# EAGLE design PowerSensingBoard (EAGLE 7.5.0)
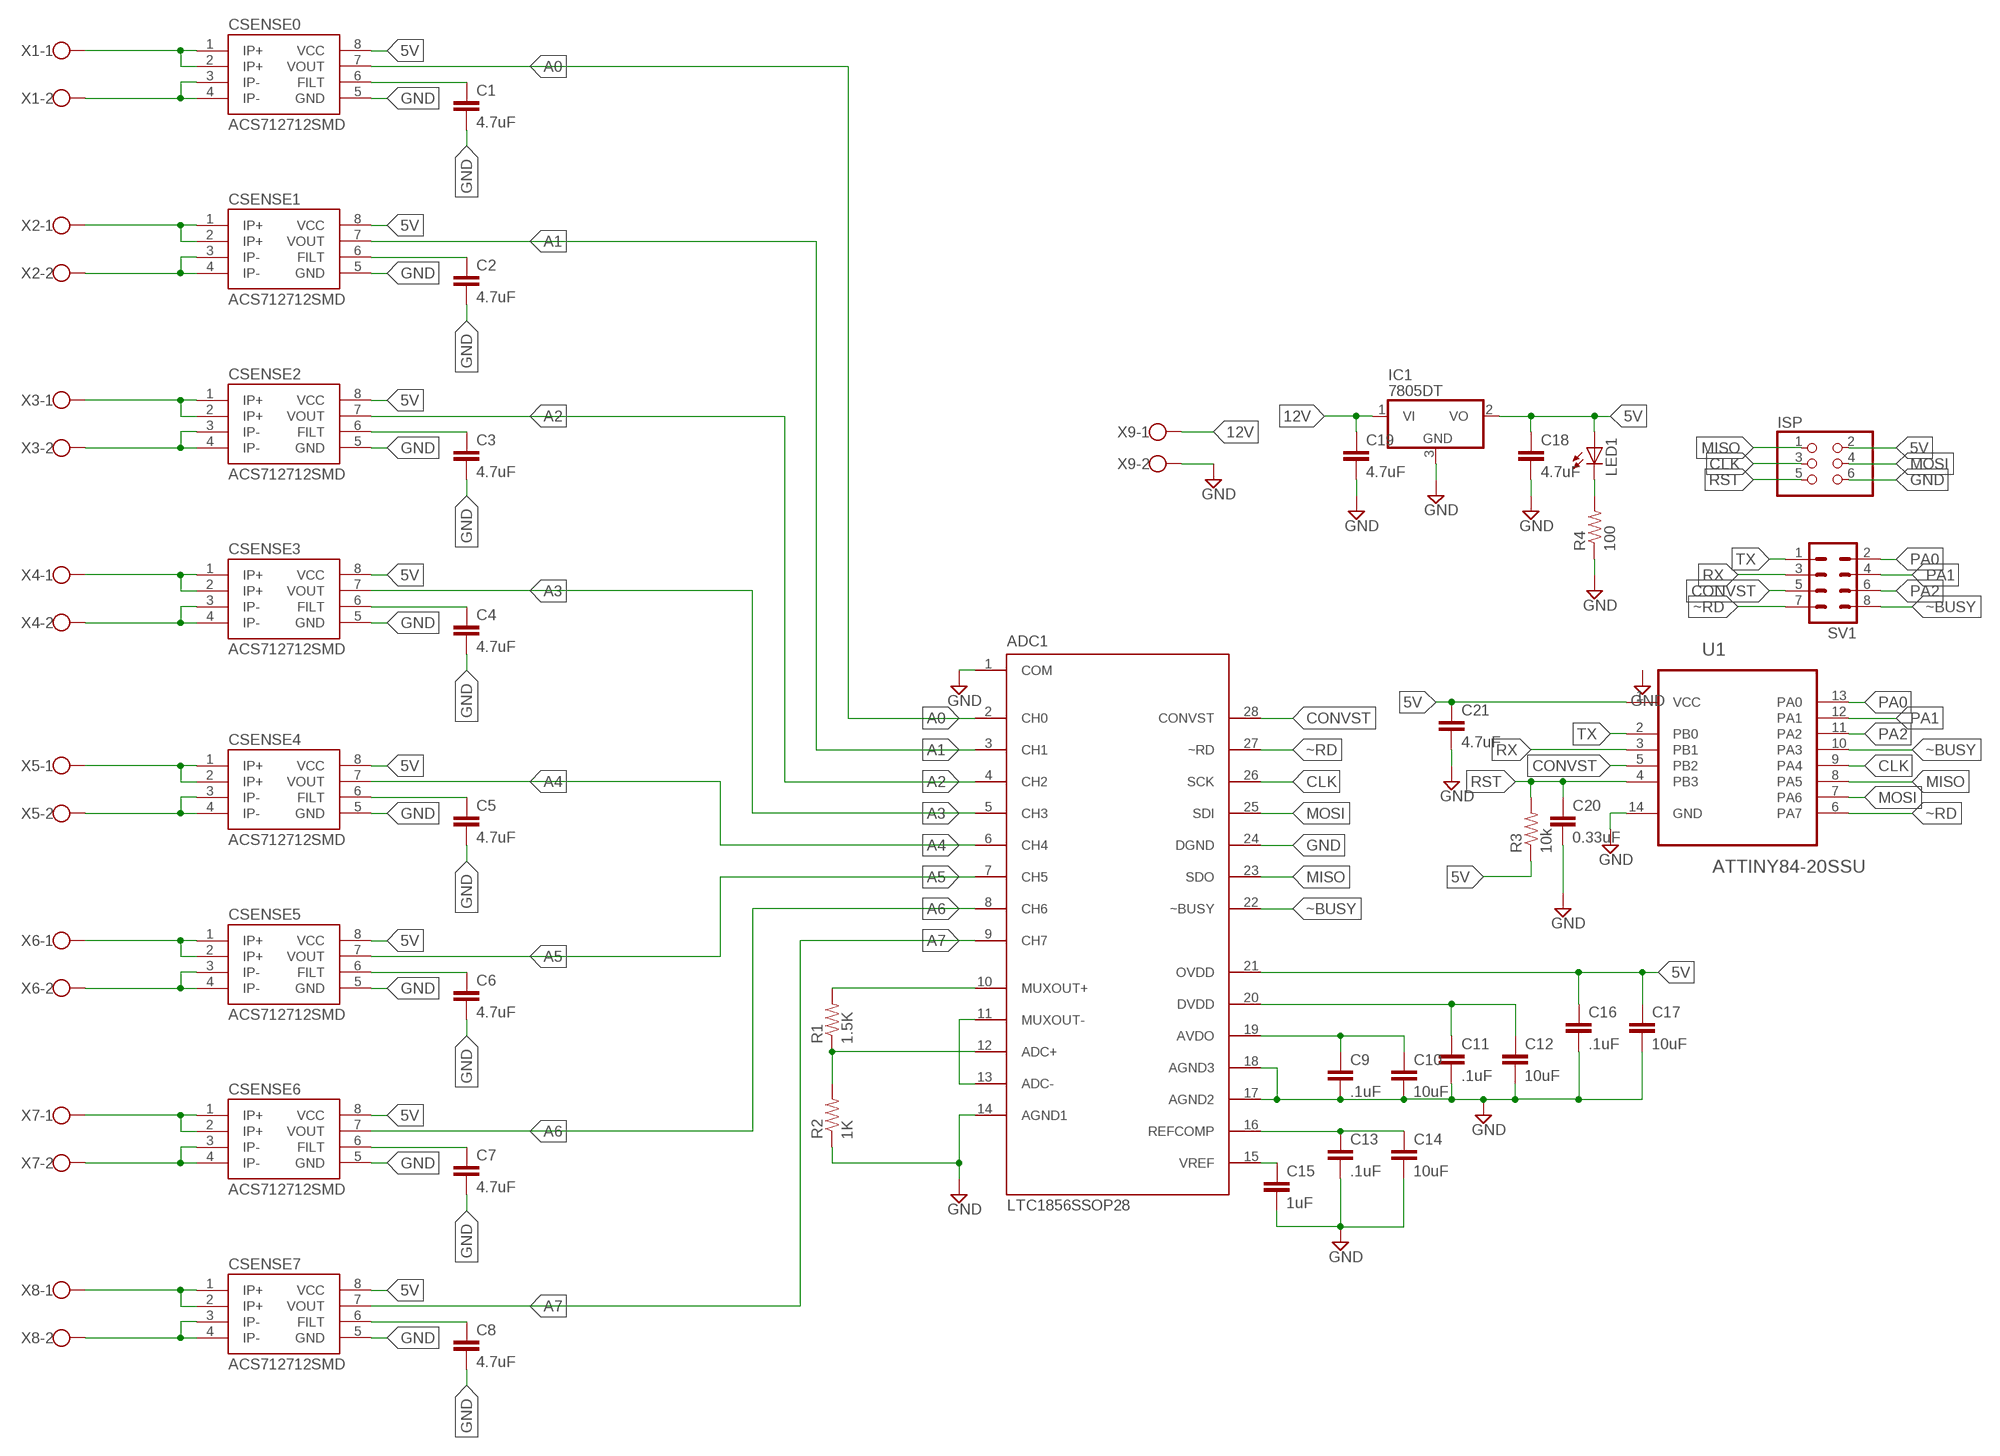
[diagram p0: schematic, sheet 1]

## Parts
ADC1  LTC1856SSOP28  [SSOP-28]
C1  4.7uF  4.7UF-6.3V-10%(0603)0603  [0603-CAP]
C2  4.7uF  4.7UF-6.3V-10%(0603)0603  [0603-CAP]
C3  4.7uF  4.7UF-6.3V-10%(0603)0603  [0603-CAP]
C4  4.7uF  4.7UF-6.3V-10%(0603)0603  [0603-CAP]
C5  4.7uF  4.7UF-6.3V-10%(0603)0603  [0603-CAP]
C6  4.7uF  4.7UF-6.3V-10%(0603)0603  [0603-CAP]
C7  4.7uF  4.7UF-6.3V-10%(0603)0603  [0603-CAP]
C8  4.7uF  4.7UF-6.3V-10%(0603)0603  [0603-CAP]
C9  .1uF  4.7UF-6.3V-10%(0603)0603  [0603-CAP]
C10  10uF  4.7UF-6.3V-10%(0603)0603  [0603-CAP]
C11  .1uF  4.7UF-6.3V-10%(0603)0603  [0603-CAP]
C12  10uF  4.7UF-6.3V-10%(0603)0603  [0603-CAP]
C13  .1uF  4.7UF-6.3V-10%(0603)0603  [0603-CAP]
C14  10uF  4.7UF-6.3V-10%(0603)0603  [0603-CAP]
C15  1uF  4.7UF-6.3V-10%(0603)0603  [0603-CAP]
C16  .1uF  4.7UF-6.3V-10%(0603)0603  [0603-CAP]
C17  10uF  4.7UF-6.3V-10%(0603)0603  [0603-CAP]
C18  4.7uF  4.7UF-6.3V-10%(0603)0603  [0603-CAP]
C19  4.7uF  4.7UF-6.3V-10%(0603)0603  [0603-CAP]
C20  0.33uF  0.33UF-50V-10%(0805)  [0805-CAP]
C21  4.7uF  4.7UF-6.3V-10%(0603)0603  [0603-CAP]
CSENSE0  ACS712712SMD  [SO08]
CSENSE1  ACS712712SMD  [SO08]
CSENSE2  ACS712712SMD  [SO08]
CSENSE3  ACS712712SMD  [SO08]
CSENSE4  ACS712712SMD  [SO08]
CSENSE5  ACS712712SMD  [SO08]
CSENSE6  ACS712712SMD  [SO08]
CSENSE7  ACS712712SMD  [SO08]
IC1  7805DT  [TO252]
ISP  PINHD-2X3  [2X03]
LED1  LEDCHIP-LED0805  [CHIP-LED0805]
R1  1.5K  1KOHM-1/10W-1%(0603)  [0603-RES]
R2  1K  1KOHM-1/10W-1%(0603)  [0603-RES]
R3  10k  0.3OHM-1/8W-1%(0805)  [0805]
R4  100  1KOHM-1/10W-1%(0603)  [0603-RES]
SV1  MA04-2  [MA04-2]
U1  ATTINY84-20SSU  [SOIC127P600X175-14N]
X1  W237-102  [W237-102]
X2  W237-102  [W237-102]
X3  W237-102  [W237-102]
X4  W237-102  [W237-102]
X5  W237-102  [W237-102]
X6  W237-102  [W237-102]
X7  W237-102  [W237-102]
X8  W237-102  [W237-102]
X9  W237-102  [W237-102]

## Nets
5V: ADC1.21(OVDD) C16.1 C17.1 C18.1 C21.1 CSENSE0.8(VCC) CSENSE1.8(VCC) CSENSE2.8(VCC) CSENSE3.8(VCC) CSENSE4.8(VCC) CSENSE5.8(VCC) CSENSE6.8(VCC) CSENSE7.8(VCC) IC1.2(VO) ISP.2 LED1.A R3.1 U1.1(VCC)
12V: C19.1 IC1.1(VI) X9.1
A0: ADC1.2(CH0) CSENSE0.7(VOUT)
A1: ADC1.3(CH1) CSENSE1.7(VOUT)
A2: ADC1.4(CH2) CSENSE2.7(VOUT)
A3: ADC1.5(CH3) CSENSE3.7(VOUT)
A4: ADC1.6(CH4) CSENSE4.7(VOUT)
A5: ADC1.7(CH5) CSENSE5.7(VOUT)
A6: ADC1.8(CH6) CSENSE6.7(VOUT)
A7: ADC1.9(CH7) CSENSE7.7(VOUT)
CLK: ADC1.26(SCK) ISP.3 U1.9(PA4)
CONVST: ADC1.28(CONVST) SV1.5 U1.5(PB2)
FILT1: C1.1 CSENSE0.6(FILT)
FILT2: C2.1 CSENSE1.6(FILT)
FILT3: C3.1 CSENSE2.6(FILT)
FILT4: C4.1 CSENSE3.6(FILT)
FILT5: C5.1 CSENSE4.6(FILT)
FILT6: C6.1 CSENSE5.6(FILT)
FILT7: C7.1 CSENSE6.6(FILT)
FILT8: C8.1 CSENSE7.6(FILT)
GND: ADC1.1(COM) ADC1.14(AGND1) ADC1.17(AGND2) ADC1.18(AGND3) ADC1.24(DGND) C1.2 C2.2 C3.2 C4.2 C5.2 C6.2 C7.2 C8.2 C9.2 C10.2 C11.2 C12.2 C13.2 C14.2 C15.2 C16.2 C17.2 C18.2 C19.2 C20.2 C21.2 CSENSE0.5(GND) CSENSE1.5(GND) CSENSE2.5(GND) CSENSE3.5(GND) CSENSE4.5(GND) CSENSE5.5(GND) CSENSE6.5(GND) CSENSE7.5(GND) IC1.3(GND) ISP.6 R2.1 R4.1 U1.14(GND) X9.2
INT1: CSENSE0.1(IP+) CSENSE0.2(IP+) X1.1
INT2: CSENSE1.1(IP+) CSENSE1.2(IP+) X2.1
INT3: CSENSE2.1(IP+) CSENSE2.2(IP+) X3.1
INT4: CSENSE3.1(IP+) CSENSE3.2(IP+) X4.1
INT5: CSENSE4.1(IP+) CSENSE4.2(IP+) X5.1
INT6: CSENSE5.1(IP+) CSENSE5.2(IP+) X6.1
INT7: CSENSE6.1(IP+) CSENSE6.2(IP+) X7.1
INT8: CSENSE7.1(IP+) CSENSE7.2(IP+) X8.1
LED1: LED1.C R4.2
MISO: ADC1.23(SDO) ISP.1 U1.8(PA5)
MOSI: ADC1.25(SDI) ISP.4 U1.7(PA6)
MUXOUT+: ADC1.10(MUXOUT+) R1.2
MUXOUT-: ADC1.12(ADC+) R1.1 R2.2
N$5: ADC1.11(MUXOUT-) ADC1.13(ADC-)
N$10: ADC1.20(DVDD) C11.1 C12.1
N$11: ADC1.19(AVDO) C9.1 C10.1
N$12: ADC1.15(VREF) C15.1
N$13: ADC1.16(REFCOMP) C13.1 C14.1
OUTT1: CSENSE0.3(IP-) CSENSE0.4(IP-) X1.2
OUTT2: CSENSE1.3(IP-) CSENSE1.4(IP-) X2.2
OUTT3: CSENSE2.3(IP-) CSENSE2.4(IP-) X3.2
OUTT4: CSENSE3.3(IP-) CSENSE3.4(IP-) X4.2
OUTT5: CSENSE4.3(IP-) CSENSE4.4(IP-) X5.2
OUTT6: CSENSE5.3(IP-) CSENSE5.4(IP-) X6.2
OUTT7: CSENSE6.3(IP-) CSENSE6.4(IP-) X7.2
OUTT8: CSENSE7.3(IP-) CSENSE7.4(IP-) X8.2
PA0: SV1.2 U1.13(PA0)
PA1: SV1.4 U1.12(PA1)
PA2: SV1.6 U1.11(PA2)
RST: C20.1 ISP.5 R3.2 U1.4(PB3)
RX: SV1.3 U1.3(PB1)
TX: SV1.1 U1.2(PB0)
~BUSY: ADC1.22(~BUSY) SV1.8 U1.10(PA3)
~RD: ADC1.27(~RD) SV1.7 U1.6(PA7)

## Library data of the parts
ADC1 = HostlerLib:LTC1856
C1-C8 C18 C19 C21 = SparkFun-Capacitors:4.7UF-6.3V-10%(0603): CAP-08280; PROD_ID: CAP-08280
C9-C17 = SparkFun-Capacitors:4.7UF-6.3V-10%(0603): CAP-08280; PROD_ID: CAP-08280; VALUE: 4.7uF
C20 = SparkFun-Capacitors:0.33UF-50V-10%(0805): CAP-08469; PROD_ID: CAP-08469
CSENSE0 CSENSE1-CSENSE7 = SparkFun-AnalogIC:ACS712: Hall-effect-based isolated linear current sensor; PROD_ID: IC-08964
IC1 = adafruit:78*: Positive VOLTAGE REGULATOR Added bigger pads to the TO-92 package
ISP = SparkFun-Connectors:PINHD-2X3: PIN HEADER
LED1 = adafruit:LED: LED OSRAM: - CHIPLED LG R971, LG N971, LY N971, LG Q971, LY Q971, LO R971, LY R971 LH N974, LH R974 LS Q976, LO Q976, LY Q976 LO Q996 - Hyper CHIPLED LW Q18S LB Q993, LB Q99A, LB R99A - SideLED LS A670, LO A670, LY A670, LG A670, LP A670 LB A673, LV A673, LT A673, LW A673 LH A674 LY A675 LS A676, LA A676, LO A676, LY A676, LW A676 LS A679, LY A679, LG A679 - Hyper Micro SIDELED® LS Y876, LA Y876, LO Y876, LY Y876 LT Y87S - SmartLED LW L88C, LW L88S LB L89C, LB L89S, LG L890 LS L89K, LO L89K, LY L89K LS L896, LA L896, LO L896, LY L896 - TOPLED LS T670, LO T670, LY T670, LG T670, LP T670 LSG T670, LSP T670, LSY T670, LOP T670, LYG T670 LG T671, LOG T671, LSG T671 LB T673, LV T673, LT T673, LW T673 LH T674 LS T676, LA T676, LO T676, LY T676, LB T676, LH T676, LSB T676, LW T676 LB T67C, LV T67C, LT T67C, LS T67K, LO T67K, LY T67K, LW E67C LS E67B, LA E67B, LO E67B, LY E67B, LB E67C, LV E67C, LT E67C LW T67C LS T679, LY T679, LG T679 LS T770, LO T770, LY T770, LG T770, LP T770 LB T773, LV T773, LT T773, LW T773 LH T774 LS E675, LA E675, LY E675, LS T675 LS T776, LA T776, LO T776, LY T776, LB T776 LHGB T686 LT T68C, LB T68C - Hyper Mini TOPLED® LB M676 - Mini TOPLED Santana® LG M470 LS M47K, LO M47K, LY M47K Source: http://www.osram.convergy.de/
R1 R4 = SparkFun-Resistors:1KOHM-1/10W-1%(0603): RES-07856; PROD_ID: RES-07856; VALUE: 1K
R2 = SparkFun-Resistors:1KOHM-1/10W-1%(0603): RES-07856; PROD_ID: RES-07856
R3 = SparkFun-Resistors:0.3OHM-1/8W-1%(0805): RES-11622; PROD_ID: RES-11622; VALUE: 0.3
SV1 = con-lstb:MA04-2: PIN HEADER; OC_FARNELL: unknown; OC_NEWARK: unknown
U1 = Atmel_By_element14_Batch_1-00:ATTINY84-20SSU: 8-bit Microcontroller with Bytes In-System Programmable Flash; MPN: ATTINY84-20SSU; OC_FARNELL: 1636955; OC_NEWARK: 03P2040; PACKAGE: SOIC-14; SUPPLIER: Atmel
X1-X9 = con-wago-500:W237-102: WAGO SCREW CLAMP; MPN: 237-102; OC_FARNELL: unknown; OC_NEWARK: 70K9898

## Board
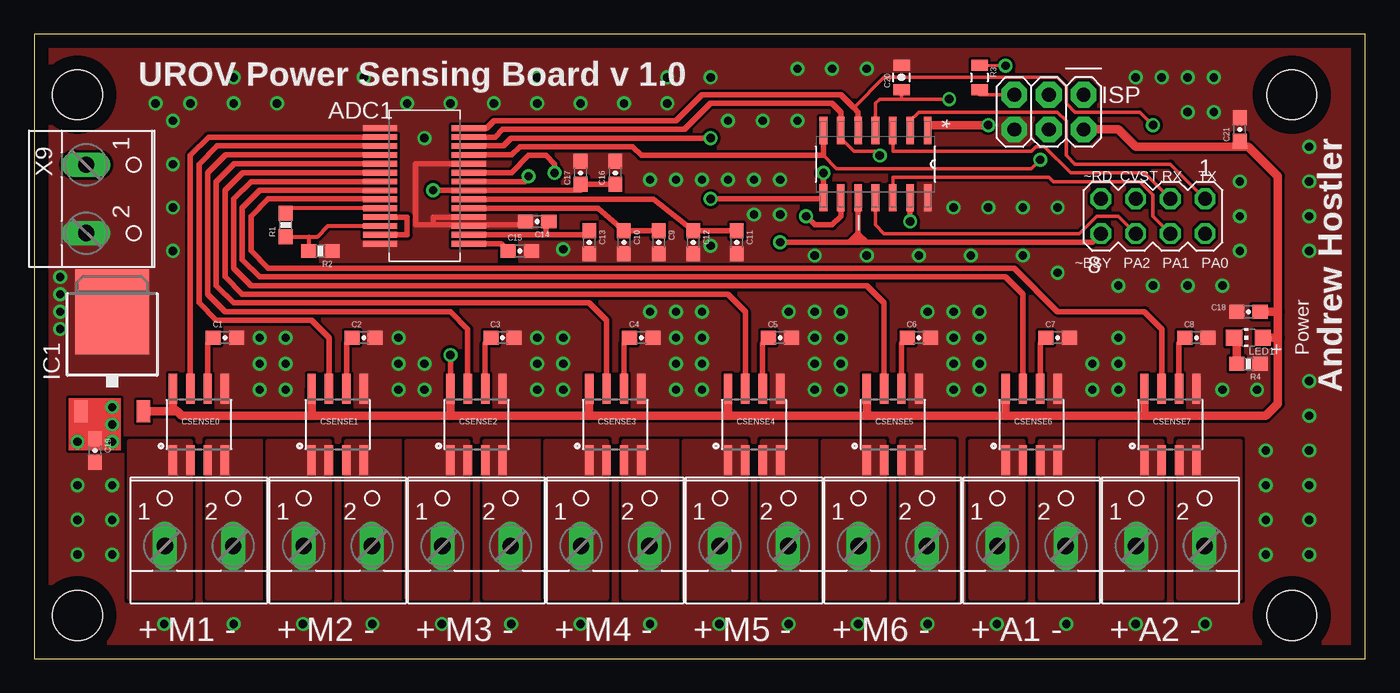
[diagram p1: board, top side]
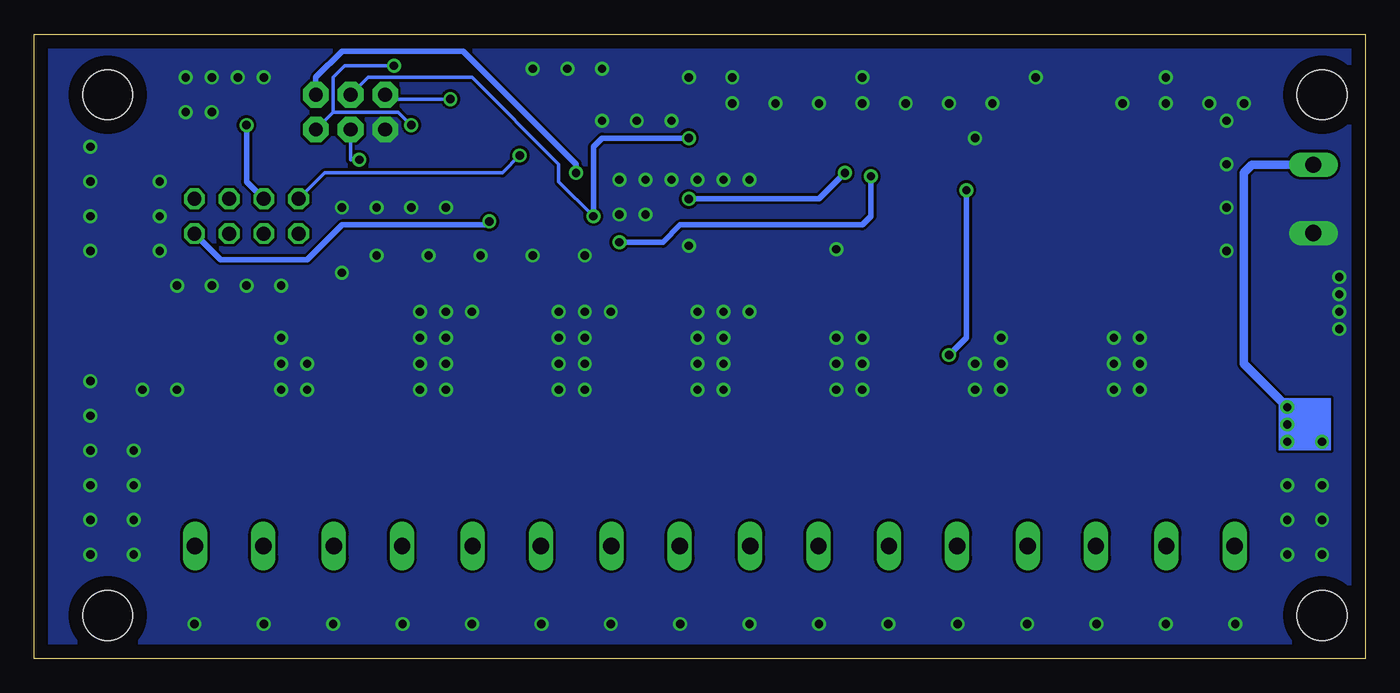
[diagram p2: board, bottom side, seen from below]

Size 97.46 x 45.71 mm. Coordinates in mm from the lower left corner, seen from the top.
Outline: 0,0 97.46,0 97.46,45.71 0,45.71 0,0
Copper layers (1*16): Top 0.035mm / dielectric 1.5mm / Bottom 0.035mm
Design rules "default *": minimum track width 10mil, minimum drill 20mil, track to track 8mil, track to pad 8mil, pad to pad 8mil, via to via 8mil, smd to smd 8mil, copper to edge 40mil, drill to drill 8mil, minimum pad ring 10mil, minimum via ring 8mil, stop-mask expansion 4mil, vias tented up to drill 0mil, thermal gap 10mil
Holes 3.66 mm at 3.17,3.17 3.17,41.27 92.08,41.27 92.08,3.17

### Footprints (pad centres in the part's own frame; a part is rotated, then mirrored left to right if it is on the bottom)
SSOP-28 = smd 2.5 x 0.42: 1 -3.25,3.9; 2 -3.25,3.25; 3 -3.25,2.6; 4 -3.25,1.95; 5 -3.25,1.3; 6 -3.25,0.65; 7 -3.25,0; 8 -3.25,-0.65; 9 -3.25,-1.3; 10 -3.25,-1.95; 11 -3.25,-2.6; 12 -3.25,-3.25; 13 -3.25,-3.9; 14 -3.25,-4.55; 15 3.25,-4.55; 16 3.25,-3.9; 17 3.25,-3.25; 18 3.25,-2.6; 19 3.25,-1.95; 20 3.25,-1.3; 21 3.25,-0.65; 22 3.25,0; 23 3.25,0.65; 24 3.25,1.3; 25 3.25,1.95; 26 3.25,2.6; 27 3.25,3.25; 28 3.25,3.9
0603-CAP = smd 1.1 x 1: 1 -0.85,0; 2 0.85,0
0805-CAP = smd 0.8 x 1.2: 1 -0.9,0; 2 0.9,0
SO08 = smd 0.61 x 2.21: 1 -1.905,-2.616; 2 -0.635,-2.616; 3 0.635,-2.616; 4 1.905,-2.616; 5 1.905,2.616; 6 0.635,2.616; 7 -0.635,2.616; 8 -1.905,2.616
TO252 = smd 1 x 1.6: 1 -2.28,-4.8; 2 2.28,-4.8 | smd 5.4 x 6.2: 3 0,2.5
2X03 = drill 1.016 pad 1.88 octagon: 1 -2.54,-1.27; 2 -2.54,1.27; 3 0,-1.27; 4 0,1.27; 5 2.54,-1.27; 6 2.54,1.27
CHIP-LED0805 = smd 1.2 x 1.2: A 0,-1.05; C 0,1.05
0603-RES = smd 1.1 x 1: 1 -0.85,0; 2 0.85,0
0805 = smd 0.8 x 1.2: 1 -0.9,0; 2 0.9,0
MA04-2 = drill 1.016 octagon: 1 -3.81,-1.27; 2 -3.81,1.27; 3 -1.27,-1.27; 4 -1.27,1.27; 5 1.27,-1.27; 6 1.27,1.27; 7 3.81,-1.27; 8 3.81,1.27
SOIC127P600X175-14N = smd 1.981 x 0.559: 1 -2.464,3.81; 2 -2.464,2.54; 3 -2.464,1.27; 4 -2.464,0; 5 -2.464,-1.27; 6 -2.464,-2.54; 7 -2.464,-3.81; 8 2.464,-3.81; 9 2.464,-2.54; 10 2.464,-1.27; 11 2.464,0; 12 2.464,1.27; 13 2.464,2.54; 14 2.464,3.81
W237-102 = drill 1.194 long: 1 -2.5,-1.27; 2 2.5,-1.27

### Placement (x,y rotation side)
ADC1  28.57,34.92 0 top
C1  13.97,23.5 0 top
C2  24.13,23.5 0 top
C3  34.29,23.5 0 top
C4  44.45,23.5 0 top
C5  54.61,23.5 0 top
C6  64.77,23.5 0 top
C7  74.93,23.5 0 top
C8  85.09,23.5 0 top
C9  45.72,30.48 270 top
C10  43.18,30.48 270 top
C11  51.44,30.48 270 top
C12  48.26,30.48 270 top
C13  40.64,30.48 270 top
C14  36.83,32 180 top
C15  35.56,29.84 0 top
C16  42.55,35.56 90 top
C17  40.01,35.56 90 top
C18  88.9,25.4 180 top
C19  4.45,15.24 270 top
C20  63.5,42.55 90 top
C21  88.27,38.73 90 top
CSENSE0  12.06,17.14 0 top
CSENSE1  22.23,17.14 0 top
CSENSE2  32.38,17.14 0 top
CSENSE3  42.55,17.14 0 top
CSENSE4  52.7,17.14 0 top
CSENSE5  62.87,17.14 0 top
CSENSE6  73.03,17.14 0 top
CSENSE7  83.19,17.14 0 top
IC1  5.71,22.9 0 top
ISP  74.3,40.01 180 top
LED1  88.9,23.5 90 top
R1  18.41,31.75 90 top
R2  20.95,29.84 180 top
R3  69.22,42.55 270 top
R4  88.9,21.59 180 top
SV1  81.92,32.38 180 top
U1  61.59,36.2 270 top
X1  12.06,9.53 0 top
X2  22.23,9.53 0 top
X3  32.38,9.53 0 top
X4  42.55,9.53 0 top
X5  52.7,9.53 0 top
X6  62.87,9.53 0 top
X7  73.03,9.53 0 top
X8  83.19,9.53 0 top
X9  5.08,33.66 270 top

### Tracks (layer width: path | path; a pad name or v marks a point on that pad's centre or on a via)
5V  (via drill 0.61)
  Top 0.254: 65.41,38.73 U1.1 | R3.1 v71.12,43.4
  Top 0.406: C16.1 C17.1 40.01,34.27 ADC1.21 29.23,34.27 v29.21,34.29 | v30.48,22.23 CSENSE2.8 | 10.47,18.1 10.48,18.1 | C21.1 88.9,37.47
  Top 0.508: 65.72,39.05 65.41,38.73
  Top 0.61: 20.32,17.78 CSENSE1.8 | CSENSE2.8 30.48,17.78 | 30.48,17.78 20.32,17.78 | CSENSE3.8 40.64,17.78 | 40.64,17.78 30.48,17.78 | CSENSE4.8 50.8,17.78 | 50.8,17.78 40.64,17.78 | CSENSE5.8 60.96,17.78 | 60.96,17.78 50.8,17.78 | CSENSE6.8 71.12,17.78 | 71.12,17.78 60.96,17.78 | CSENSE7.8 81.28,17.78 | 81.28,17.78 71.12,17.78 | CSENSE0.8 10.16,18.41 10.48,18.1 10.79,17.78 20.32,17.78 | v69.85,39.05 65.72,39.05 | 81.28,17.78 90.17,17.78 91.06,18.68 91.06,23.5 | ISP.2 79.38,38.73 80.64,37.47 88.9,37.47 91.06,35.3 91.06,25.4 | 91.06,23.5 91.06,25.4 | C18.1 91.06,25.4 | LED1.A 91.06,23.5
  Top 0.635: IC1.2 10.47,18.1
  Bottom 0.254: v69.85,39.05 70.8,40.01 75.56,40.01 | v71.12,43.4 74.72,43.4 75.56,42.55 75.56,40.01 | 75.56,40.01 ISP.2
  Bottom 0.406: v29.21,34.29 29.21,23.5 v30.48,22.23
12V  (via drill 0.6)
  Top 0.406: 5.4,18.1 v3.17,15.88 | v5.71,18.41 v5.71,17.14 v5.71,15.88 C19.1
  Top 0.61: v5.71,18.41 5.4,18.1 IC1.1
  Bottom 0.61: X9.1 8.29,36.16 8.89,35.56 8.89,21.59 v5.71,18.41
A0
  Top 0.406: ADC1.2 12.78,38.17 11.43,36.83 CSENSE0.7
A1
  Top 0.406: ADC1.3 13.39,37.52 12.06,36.2 12.06,26.04 13.34,24.77 20.32,24.77 21.59,23.5 CSENSE1.7
A2
  Top 0.406: ADC1.4 14.02,36.88 12.7,35.56 12.7,26.67 13.97,25.4 30.48,25.4 31.75,24.13 CSENSE2.7
A3
  Top 0.406: ADC1.5 14.63,36.23 13.34,34.92 13.34,27.3 14.61,26.04 40.64,26.04 41.91,24.77 CSENSE3.7
A4
  Top 0.406: ADC1.6 15.26,35.58 13.97,34.29 13.97,27.94 15.24,26.67 50.8,26.67 52.07,25.4 CSENSE4.7
A5
  Top 0.406: ADC1.7 15.88,34.92 14.61,33.66 14.61,28.57 15.88,27.3 60.96,27.3 62.23,26.04 CSENSE5.7
A6
  Top 0.406: ADC1.8 16.5,34.27 15.24,33.02 15.24,29.21 16.51,27.94 71.12,27.94 72.39,26.67 CSENSE6.7
A7
  Top 0.406: ADC1.9 25.3,33.66 17.14,33.66 15.88,32.38 15.88,29.84 17.14,28.57 71.75,28.57 74.93,25.4 81.28,25.4 82.55,24.13 CSENSE7.7
CLK  (via drill 0.61)
  Top 0.406: ADC1.26 34.35,37.52 34.92,38.1 v49.53,38.1 | U1.9 59.05,32.38 58.42,31.75 57.15,31.75 v56.52,32.38
  Bottom 0.254: ISP.3 73.03,42.55 65.41,42.55 59.05,36.2 59.05,34.92 v56.52,32.38
  Bottom 0.406: v56.52,32.38 56.52,37.47 55.88,38.1 v49.53,38.1
CONVST  (via drill 0.61)
  Top 0.254: v81.92,39.05 80.96,40.01 76.2,40.01 75.56,40.64 75.56,41.91 74.93,42.55 62.23,42.55 60.01,40.32
  Top 0.406: ADC1.28 33.11,38.83 33.66,39.37 46.99,39.37 48.9,41.27 59.05,41.27 60.01,40.32 60.33,40.01 U1.5
  Bottom 0.406: v81.92,39.05 81.92,34.92 SV1.5
FILT1
  Top 0.406: CSENSE0.6 12.7,23.07 C1.1
FILT2
  Top 0.406: CSENSE1.6 22.86,23.07 C2.1
FILT3
  Top 0.406: CSENSE2.6 33.02,23.07 C3.1
FILT4
  Top 0.406: CSENSE3.6 43.18,23.07 C4.1
FILT5
  Top 0.406: CSENSE4.6 53.34,23.07 C5.1
FILT6
  Top 0.406: CSENSE5.6 63.5,23.07 C6.1
FILT7
  Top 0.406: CSENSE6.6 73.66,23.07 C7.1
FILT8
  Top 0.406: CSENSE7.6 83.82,23.07 C8.1
GND  (via drill 0.61)
  Top 0.406: ADC1.24 27.94,36.23 27.94,31.75 35.98,31.75 C14.2 | ADC1.18 29.21,32.33 29.21,31.75
  other vias: 16.51,21.59 26.67,21.59 36.83,21.59 46.99,21.59 57.15,21.59 67.31,21.59 77.47,21.59 87,27.3 79.38,27.3 3.17,12.7 3.17,7.62 86.36,40.01 84.45,40.01 90.17,12.7 93.34,7.62 55.88,43.18 54.61,35.05 46.35,42.55 28.57,38.1 27.3,40.64 14.61,40.64 8.89,40.64 52.7,35.05 38.73,29.97 54.61,32.51 52.7,32.51 46.99,35.05 45.09,35.05 18.41,21.59 28.57,21.59 38.73,21.59 48.9,21.59 59.05,21.59 69.22,21.59 79.38,21.59 81.92,27.3 84.45,27.3 69.85,33.02 72.39,33.02 74.93,33.02 67.31,33.02 49.53,30.23 57.15,29.51 60.96,29.51 64.77,29.51 68.58,29.51 72.39,29.51 74.93,28.24 84.45,42.55 86.36,42.55 82.55,42.55 80.64,42.55 33.66,40.64 36.83,40.64 40.01,40.64 43.18,40.64 14.61,2.54 19.68,2.54 24.77,2.54 29.84,2.54 34.92,2.54 40.01,2.54 45.09,2.54 50.16,2.54 55.24,2.54 60.33,2.54 65.41,2.54 70.48,2.54 75.56,2.54 80.64,2.54 85.72,2.54 50.8,39.37 53.34,39.37 55.88,39.37 89.53,19.68 87,19.68 93.34,29.84 93.34,20.32 93.34,17.78 18.41,23.5 18.41,19.68 28.57,19.68 26.67,19.68 16.51,19.68 36.83,19.68 38.73,19.68 48.9,23.5 48.9,19.68 46.99,19.68 38.73,23.5 59.05,23.5 59.05,19.68 57.15,19.68 69.22,23.5 69.22,19.68 67.31,19.68 79.38,23.5 79.38,19.68 77.47,19.68 67.31,23.5 67.31,25.4 69.22,25.4 65.41,25.4 57.15,25.4 59.05,25.4 57.15,23.5 55.24,25.4 46.99,23.5 46.99,25.4 48.9,25.4 45.09,25.4 36.83,23.5 26.67,23.5 16.51,23.5 93.34,32.38 93.34,34.92 93.34,37.47 93.34,15.24 93.34,12.7 93.34,10.16 1.91,27.94 1.91,26.67 1.91,25.4 1.91,24.13 3.17,10.16 5.71,12.7 5.71,10.16 5.71,7.62 11.43,40.64 17.78,40.64 30.48,40.64 58.42,43.18 60.96,43.18 88.27,29.84 88.27,32.38 88.27,34.92 10.16,39.37 10.16,36.2 10.16,33.02 10.16,29.84 9.53,2.54 90.17,15.24 90.17,10.16 90.17,7.62 48.9,35.05 50.8,35.05 49.53,42.55 36.83,42.55 46.35,40.64 14.61,42.55 24.13,42.55
  pour Top (rank 5, no thermals): 0,45.72 100.33,45.72 100.33,0 0,0
  pour Bottom (rank 4, no thermals): 0,45.72 97.79,45.72 97.79,0 0,0
INT1
  pour Top (no thermals): 6.99,15.88 11.43,15.88 11.43,4.45 6.99,4.45
INT2
  pour Top (no thermals): 17.14,15.88 21.59,15.88 21.59,4.45 17.14,4.45
INT3
  pour Top (no thermals): 27.3,15.88 31.75,15.88 31.75,4.45 27.3,4.45
INT4
  pour Top (no thermals): 37.47,15.88 41.91,15.88 41.91,4.45 37.47,4.45
INT5
  pour Top (no thermals): 47.62,15.88 52.07,15.88 52.07,4.45 47.62,4.45
INT6
  pour Top (no thermals): 57.78,15.88 62.23,15.88 62.23,4.45 57.78,4.45
INT7
  pour Top (no thermals): 68.58,15.88 72.39,15.88 72.39,4.45 68.58,4.45
INT8
  pour Top (no thermals): 78.11,15.88 82.55,15.88 82.55,4.45 78.11,4.45
LED1
  Top 0.61: LED1.C 88.05,23.3 R4.2
MISO  (via drill 0.61)
  Top 0.406: v49.53,33.66 57.71,33.66 U1.8 v57.78,35.56 | v38.1,35.56 38.1,36.2 37.47,36.83 36.2,36.83 34.94,35.58 ADC1.23
  Bottom 0.406: ISP.1 76.83,42.55 74.93,44.45 66.04,44.45 57.78,36.2 v57.78,35.56 | v38.1,35.56 40.01,33.66 v49.53,33.66
MOSI  (via drill 0.61)
  Top 0.254: v73.66,36.51 73.03,35.88 58.74,35.88 57.78,36.83
  Top 0.406: U1.7 57.78,36.83 44.45,36.83 43.81,37.47 35.56,37.47 34.97,36.88 ADC1.25
  Bottom 0.254: ISP.4 74.3,36.51 v73.66,36.51
MUXOUT+
  Top 0.305: ADC1.10 18.41,32.98 R1.2
MUXOUT-
  Top 0.305: R1.1 20.11,30.9 | 20.11,30.9 R2.2 | 20.11,30.9 20.74,30.9 21.52,31.68 ADC1.12
N$5
  Top 0.406: ADC1.13 27.3,31.02 27.3,32.33 ADC1.11
N$10
  Top 0.406: C11.1 C12.1 45.33,33.62 ADC1.20
N$11
  Top 0.406: ADC1.19 41.27,32.98 C10.1 C9.1
N$12
  Top 0.406: ADC1.15 34.18,30.38 C15.1
N$13
  Top 0.406: ADC1.16 37.47,31.02 | 37.47,31.02 40.64,31.02 C13.1 | C14.1 37.47,32 37.47,31.02
OUTT1
  pour Top (rank 2, no thermals): 12.7,15.88 17.14,15.88 17.14,4.45 12.7,4.45
OUTT2
  pour Top (rank 2, no thermals): 22.86,15.88 27.3,15.88 27.3,4.45 22.86,4.45
OUTT3
  pour Top (rank 2, no thermals): 33.02,15.88 37.47,15.88 37.47,4.45 33.02,4.45
OUTT4
  pour Top (rank 2, no thermals): 43.18,15.88 47.62,15.88 47.62,4.45 43.18,4.45
OUTT5
  pour Top (rank 2, no thermals): 53.34,15.88 57.78,15.88 57.78,4.45 53.34,4.45
OUTT6
  pour Top (rank 2, no thermals): 63.5,15.88 67.31,15.88 67.31,4.45 63.5,4.45
OUTT7
  pour Top (rank 2, no thermals): 73.66,15.88 78.11,15.88 78.11,4.45 73.66,4.45
OUTT8
  pour Top (rank 2, no thermals): 83.82,15.88 88.27,15.88 88.27,4.45 83.82,4.45
PA0  (via drill 0.61)
  Top 0.406: U1.13 v64.14,32
  Bottom 0.406: v64.14,32 64.39,31.75 74.93,31.75 77.47,29.21 83.82,29.21 SV1.2
PA1
  Top 0.254: U1.12 62.87,35.24 74.3,35.24 74.61,34.92 80.96,34.92 81.92,33.97 81.92,32.38 SV1.4
PA2
  Top 0.254: U1.11 61.59,31.75 62.23,31.11 76.52,31.11 77.79,32.38 79.38,32.38 SV1.6
RST  (via drill 0.61)
  Top 0.254: U1.4 61.59,40.64 61.91,40.96 63.5,40.96 | 63.5,40.96 v66.99,40.96 | 63.5,40.96 C20.1 | ISP.5 69.22,41.27 R3.2
  Bottom 0.254: v66.99,40.96 71.44,40.96 ISP.5
RX
  Top 0.254: U1.3 62.87,37.15 73.03,37.15 73.34,37.47 73.98,37.47 75.88,35.56 81.28,35.56 SV1.3
TX
  Top 0.254: U1.2 64.14,39.37 64.77,40.01 74.93,40.01 75.56,39.37 75.56,36.83 76.2,36.2 83.19,36.2 SV1.1
~BUSY  (via drill 0.61)
  Top 0.406: v54.61,30.48 59.69,30.48 | 59.69,30.48 60.33,31.11 | ADC1.22 35.94,34.92 v36.2,35.31 | 59.69,30.48 60.33,30.48 | 60.33,30.48 60.33,31.11 | U1.10 60.33,31.11 | 60.33,31.11 60.96,30.48 | 60.96,30.48 77.47,30.48 SV1.8 | 60.96,30.48 60.33,30.48
  Bottom 0.406: v36.2,35.31 36.2,32.38 36.83,31.75 50.16,31.75 51.44,30.48 v54.61,30.48
~RD  (via drill 0.61)
  Top 0.254: v61.91,36.83 61.59,37.15 60.01,37.15 59.05,38.1 U1.6
  Top 0.406: ADC1.27 33.73,38.17 34.29,38.73 47.62,38.73 49.53,40.64 58.42,40.64 59.05,40.01 U1.6
  Bottom 0.254: SV1.7 76.2,35.56 63.18,35.56 v61.91,36.83
(copper drawn outside any net)
  shapes: Bottom area x1, Top area x1

### Text on the board
tPlace: UROV Power Sensing Board v 1.0 | Andrew Hostler
tNames: ~RD CVST RX TX | ~BSY PA2 PA1 PA0 | Power | + M1 - | + M2 - | + M3 - | + M4 - | + M5 - | + M6 - | + A1 - | + A2 -